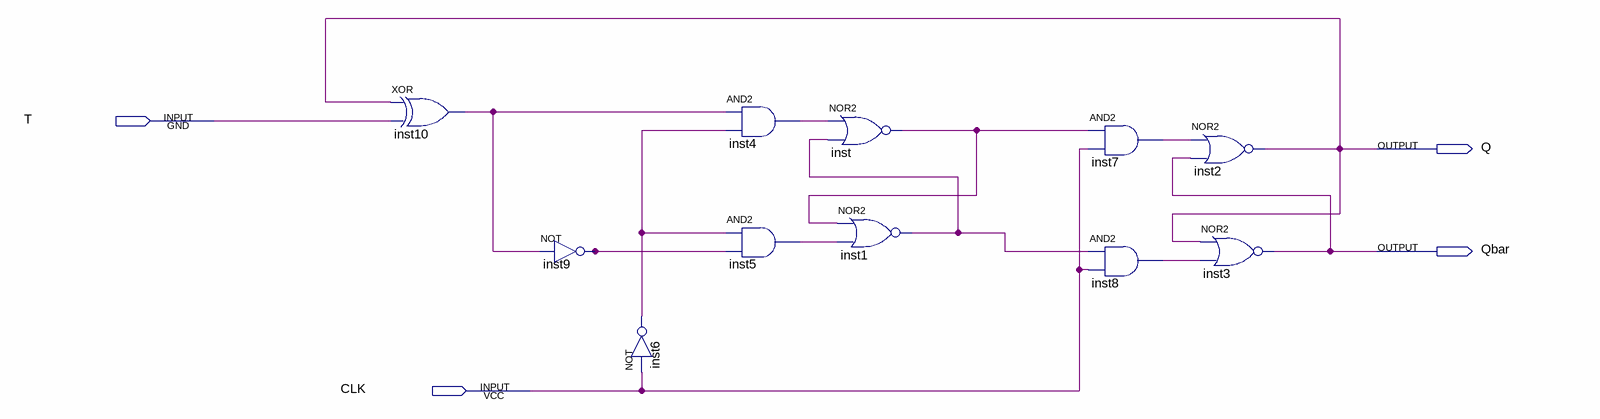
[diagram p0: schematic sheet]
// Quartus schematic T_FlipFlop.bdf as structural Verilog: 11 symbols, 4 pins
module T_FlipFlop (
  input  T,
  input  CLK,
  output Q,
  output Qbar
);

  wire inst1_out, inst4_out, inst5_out, inst6_out, inst7_out, inst8_out, inst9_out, inst10_out, inst_out;

  xor inst10 (inst10_out, Q, T);
  not inst9 (inst9_out, inst10_out);
  not inst6 (inst6_out, CLK);
  and inst4 (inst4_out, inst10_out, inst6_out);
  and inst5 (inst5_out, inst6_out, inst9_out);
  nor inst (inst_out, inst4_out, inst1_out);
  nor inst1 (inst1_out, inst_out, inst5_out);
  and inst7 (inst7_out, inst_out, CLK);
  and inst8 (inst8_out, inst1_out, CLK);
  nor inst2 (Q, inst7_out, Qbar);
  nor inst3 (Qbar, Q, inst8_out);
endmodule
